# Altium schematic sheet IF 2.SchDoc
size A3; SheetNumber: 6; SheetTotal: 13
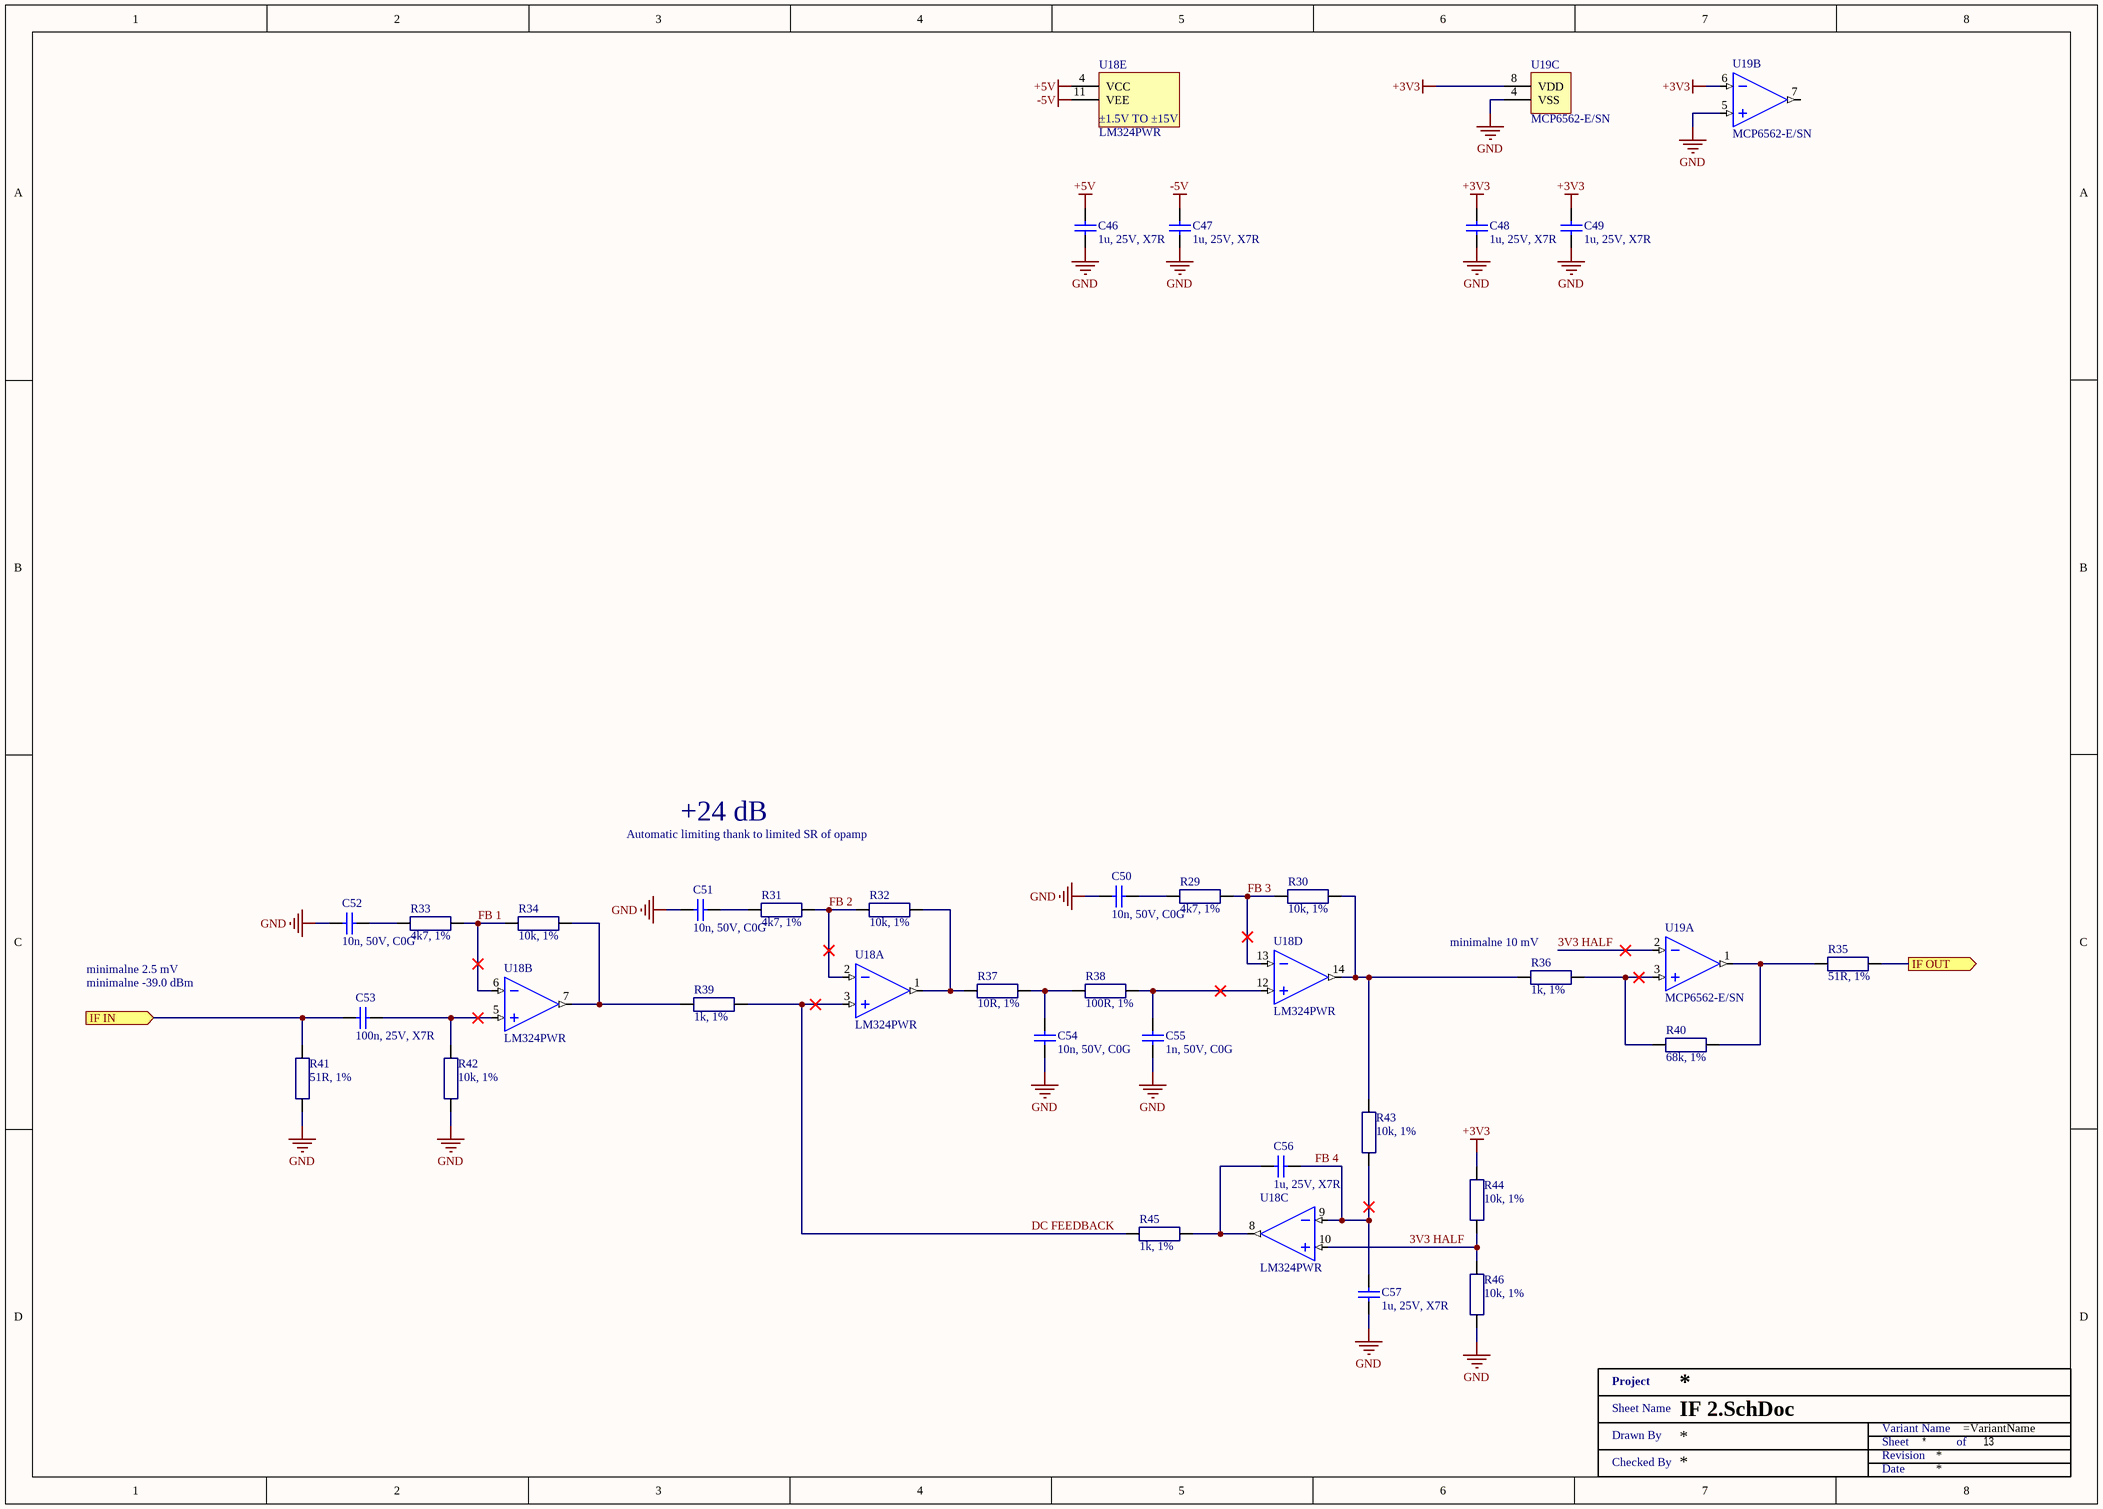
[diagram p0: IF 2.SchDoc]

## Parts
C46  1u, 25V, X7R  [SMD0603]
C47  1u, 25V, X7R  [SMD0603]
C48  1u, 25V, X7R  [SMD0603]
C49  1u, 25V, X7R  [SMD0603]
C50  10n, 50V, C0G  [SMD0603]
C51  10n, 50V, C0G  [SMD0603]
C52  10n, 50V, C0G  [SMD0603]
C53  100n, 25V, X7R  [SMD0603]
C54  10n, 50V, C0G  [SMD0603]
C55  1n, 50V, C0G  [SMD0603]
C56  1u, 25V, X7R  [SMD0603]
C57  1u, 25V, X7R  [SMD0603]
R29  4k7, 1%  [SMD0603 - R]
R30  10k, 1%  [SMD0603 - R]
R31  4k7, 1%  [SMD0603 - R]
R32  10k, 1%  [SMD0603 - R]
R33  4k7, 1%  [SMD0603 - R]
R34  10k, 1%  [SMD0603 - R]
R35  51R, 1%  [SMD0603 - R]
R36  1k, 1%  [SMD0603 - R]
R37  10R, 1%  [SMD0603 - R]
R38  100R, 1%  [SMD0603 - R]
R39  1k, 1%  [SMD0603 - R]
R40  68k, 1%  [SMD0603 - R]
R41  51R, 1%  [SMD0603 - R]
R42  10k, 1%  [SMD0603 - R]
R43  10k, 1%  [SMD0603 - R]
R44  10k, 1%  [SMD0603 - R]
R45  1k, 1%  [SMD0603 - R]
R46  10k, 1%  [SMD0603 - R]
U18  LM324PWR  [TSSOP14]  (parts A,B,C,D,E of 5)
U19  MCP6562-E/SN  [SOIC08]  (parts A,B,C of 3)
XX?  Title 1  (value not drawn)  (graphical)

## Ports
IF IN (in), IF OUT (out)

## Nets
+3V3: C48.2 C49.2 R44.2 U19.6(INB-) U19.8(VDD)
+5V: C46.2 U18.4(VCC)
-5V: C47.2 U18.11(VEE)
GND: C46.1 C47.1 C48.1 C49.1 C50.1 C51.1 C52.1 C54.1 C55.1 C57.1 R41.1 R42.1 R46.1 U19.4(VSS) U19.5(INB+)
3V3 HALF: R44.1 R46.2 U18.10(+IN_C) U19.2(INA-)
DC FEEDBACK: R39.2 R45.1 U18.3(+IN_A)
FB 1: R33.2 R34.1 U18.6(-IN_B)
FB 2: R31.2 R32.1 U18.2(-IN_A)
FB 3: R29.2 R30.1 U18.13(-IN_D)
FB 4: C56.1 C57.2 R43.1 U18.9(-IN_C)
IF IN: C53.1 R41.2 ; port IF IN
IF OUT: R35.2 ; port IF OUT
NetC50_2: C50.2 R29.1
NetC51_2: C51.2 R31.1
NetC52_2: C52.2 R33.1
NetC53_2: C53.2 R42.2 U18.5(+IN_B)
NetC54_2: C54.2 R37.2 R38.1
NetC55_2: C55.2 R38.2 U18.12(+IN_D)
NetC56_2: C56.2 R45.2 U18.8(OUT_C)
NetR30_2: R30.2 R36.1 R43.2 U18.14(OUT_D)
NetR32_2: R32.2 R37.1 U18.1(OUT_A)
NetR34_2: R34.2 R39.1 U18.7(OUT_B)
NetR35_1: R35.1 R40.2 U19.1(OUTA)
NetR36_2: R36.2 R40.1 U19.3(INA+)

Not connected (* = marked no-connect by the designer): U19 7(OUTB)

## Notes on the sheet
- Automatic limiting thank to limited SR of opamp
- +24 dB
- minimalne 2.5 mV
- minimalne -39.0 dBm
- (near R36) minimalne 10 mV
- (in symbol LM324PWR, part E) ±1.5V TO ±15V
- (in symbol Title 1) Project; Sheet Name; Variant Name; Drawn By; Sheet; of; Revision; Checked By; Date

## Library data of the parts
C46-C49 C56 C57 = CGA3E1X7R1E105K080AC: CAP CER 1UF 25V X7R 0603; Manufacturer: TDK Corporation; Tolerance: ±10%; Manufacturer Part Number: CGA3E1X7R1E105K080AC; RoHS: RoHS Compliant; Category: Capacitors; Stock 1: 109509; Pricing 1: 1=0.2, 10=0.135, 100=0.0686, 500=0.04696, 1000=0.04154 (USD); Packaging: Cut Tape (CT); Part Status: Active; Voltage - Rated: 25V; Temperature Coefficient: X7R; Operating Temperature: -55°C ~ 125°C; Features: -; Ratings: AEC-Q200; Applications: Automotive; Failure Rate: -; Mounting Type: Surface Mount, MLCC; Package / Case: 0603 (1608 Metric); Size / Dimension: 0.063" L x 0.032" W (1.60mm x 0.80mm); Height - Seated (Max): -; Thickness (Max): 0.035" (0.90mm); Lead Spacing: -; Lead Style: -; ComponentLink1URL: https://product.tdk.com/info/en/catalog/datasheets/mlcc_automotive_general_en.pdf; ComponentLink1Description: https://product.tdk.com/info/en/catalog/datasheets/mlcc_automotive_general_en.pdf; Capacitance: 1u; Supplier 1: Mouser; Supplier Part Number 1: 810-CGA3E1X7R1E105K; Supplier 2: Farnell; Supplier Part Number 2: 2346962; Supplier 3: Digi-Key; Supplier Part Number 3: 445-6931-1-ND
C50-C52 C54 = GRM1885C1H103JA01D: Multilayer Ceramic Capacitors MLCC - SMD/SMT 0603 50VDC 10000pF 5% C0G; Manufacturer: Murata Electronics; Type: Chip Multilayer Ceramic Capacitor for General Purpose; Capacitance - nF: 10 nF; Class: Class 1; CNHTS: 8532241000; Dielectric: C0G (NP0); TARIC: 8532240000; Supplier 1: Mouser; Supplier Part Number 1: 81-GRM1885C1H103JA1D; Manufacturer Part Number: GRM1885C1H103JA01D; RoHS: RoHS Compliant; Category: Multilayer Ceramic Capacitors MLCC - SMD/SMT; Stock 1: 217291; Pricing 1: 1=0.183, 10=0.129, 100=0.065, 500=0.045, 1000=0.039, 4000=0.030, 8000=0.027, 24000=0.025 (EUR); Capacitance: 10n; Height: 0.8 mm; Length: 1.6 mm; Package / Case: 0603 (1608 metric); Packaging: Cut Tape; Product: General Type MLCCs; Series: GRM; Termination Style: SMD/SMT; Tolerance: 5 %; Voltage Rating DC: 50 VDC; Width: 0.8 mm; Brand: Murata Electronics; Capacitance - pF: 10000 pF; Case Code - in: 0603; Case Code - mm: 1608; HTS Code: 8532240020; Maximum Operating Temperature: + 125 C; Minimum Operating Temperature: - 55 C; Product Type: Ceramic Capacitors; Standard Pack Qty: 4000; Subcategory: Capacitors; Termination: Standard; RoHS - Mouser: Y; Minimum Order Quantity: 1; Reeling: True; ComponentLink1URL: http://www.mouser.com/datasheet/2/281/murata_03052018_GRM_Series_1-1310166.pdf; ComponentLink1Description: http://www.mouser.com/datasheet/2/281/murata_03052018_GRM_Series_1-1310166.pdf; Supplier 2: Farnell; Supplier Part Number 2: 2456107
C53 = 06033C104KAT2A: AVX - 06033C104KAT2A - CAP, MLCC, X7R, 0.1UF, 25V, 0603; Ceramic Capacitor Case: 0603 [1608 Metric]; Voltage Rating: 25; Capacitance Tolerance: ± 10%; Dielectric Characteristic: X7; Product Range: AVX 0603 MLCC; SVHC: No SVHC (17-Dec-2015)<!--FANDB--><div class="features-and-benefits-container"><div class="features-and-benefits-desc-container"><span class="features-and-benefits-container-desc">SMD Multilayer Ceramic Capacitor, 0603 [1608 Metric], 0.1 µF, 25 V, ± 10%, X7R, AVX 0603 MLCC</span></div><div class="features-and-benefits-description"><span class="features-benefits-value">The 06033C104KAT2A is a SMD Multilayer Ceramic Capacitor with Ni/Sn-plated termination, X7R dielectric and 0603 case. X7R formulations are called temperature stable ceramics and fall into EIA class II materials. X7R is the most popular of this intermediate dielectric constant material. This capacitance change is non-linear. Capacitance for X7R varies under the influence of electrical operating conditions such as voltage and frequency. X7; Supplier 1: Farnell; Supplier Part Number 1: 2530141; Manufacturer: AVX; Manufacturer Part Number: 06033C104KAT2A; RoHS: YES; Stock 1: 22809; Pricing 1: 10=0.012, 100=0.0096, 500=0.0069, 1000=0.006, 2000=0.0048, 4000=0.0038, 20000=0.0027, 40000=0.0026 (GBP); Capacitance: 100n; Packaging: Cut Tape; Operating Temperature Min: -55; Operating Temperature Max: 125; Automotive Qualification Standard: -; MSL: MSL 1 - Unlimited; ComponentLink1URL: http://www.farnell.com/datasheets/2237835.pdf; ComponentLink1Description: http://www.farnell.com/datasheets/2237835.pdf; Supplier 2: Digi-Key; Supplier Part Number 2: 478-3714-1-ND
C55 = MCU0603C102JCT: MULTICOMP - MCU0603C102JCT - CAP, MLCC, C0G/NP0, 1NF, 50V, 0603; Ceramic Capacitor Case: 0603 [1608 Metric]; Voltage Rating: 50; Capacitance Tolerance: ± 5%; Product Range: MCU Series; SVHC: No SVHC (07-Jul-2017); Capacitance Tolerance +: 5%; Capacitor Terminals: SMD; External Depth: 0.8; External Length / Height: 1.6; No. of Pins: 2; Reel Quantity: 4000; Temperature Coefficient: 0ppm/°C ± 30; Voltage Rating V DC: 50V<!--FANDB--><div class="features-and-benefits-container"><div class="features-and-benefits-desc-container"><span class="features-and-benefits-container-desc">SMD Multilayer Ceramic Capacitor, 0603 [1608 Metric], 1000 pF, 50 V, ± 5%, C0G / NP0; Supplier 1: Farnell; Supplier Part Number 1: 9406131; Manufacturer: MULTICOMP; Manufacturer Part Number: MCU0603C102JCT; RoHS: YES; Stock 1: 25831; Pricing 1: 10=0.0164, 100=0.0133, 500=0.0095, 1000=0.0082, 2000=0.0065 (GBP); Capacitance: 1n; Dielectric Characteristic: C0G / NP0; Packaging: Cut Tape; Operating Temperature Min: -55; Operating Temperature Max: 125; Automotive Qualification Standard: -; MSL: -; Capacitance Tolerance ±: ± 5%; External Width: 0.8; Operating Temperature Range: -55°C to +125; Tape Width: 8; Tolerance +: 5%; Tolerance -: 5%; ComponentLink1URL: http://www.farnell.com/datasheets/1723231.pdf; ComponentLink1Description: http://www.farnell.com/datasheets/1723231.pdf
R29 R31 R33 = AC0603FR-074K7L: RES SMD 4.7K OHM 1% 1/10W 0603; Manufacturer: Yageo; Power (Watts): 0.1W, 1/10W; Temperature Coefficient: ±100ppm/°C; Manufacturer Part Number: AC0603FR-074K7L; RoHS: RoHS Compliant; Category: Resistors; Stock 1: 391581; Pricing 1: 1=0.1, 10=0.025, 100=0.01, 1000=0.00448, 2500=0.00389 (USD); Packaging: Cut Tape (CT); Part Status: Active; Tolerance: ±1%; Composition: Thick Film; Features: Automotive AEC-Q200, Moisture Resistant; Operating Temperature: -55°C ~ 155°C; Package / Case: 0603 (1608 Metric); Supplier Device Package: 0603; Size / Dimension: 0.063" L x 0.032" W (1.60mm x 0.80mm); Height - Seated (Max): 0.022" (0.55mm); Failure Rate: -; ComponentLink1URL: http://www.yageo.com/NewPortal/yageodocoutput?fileName=/pdf/R-Chip/PYu-AC_51_RoHS_L_6.pdf; ComponentLink1Description: http://www.yageo.com/NewPortal/yageodocoutput?fileName=/pdf/R-Chip/PYu-AC_51_RoHS_L_6.pdf; Resistance: 4k7; Supplier 1: Mouser; Supplier Part Number 1: 603-AC0603FR-074K7L; Supplier 2: Digi-Key; Supplier Part Number 2: YAG3613CT-ND; Supplier 3: Future Electronics; Supplier Part Number 3: AC0603FR-074K7L-CUTT
R30 R32 R34 R42-R44 R46 = RC0603FR-0710KL: YAGEO (PHYCOMP) - RC0603FR-0710KL - RES, THICK FILM, 10K, 1%, 0.1W, 0603; Voltage Rating: 50; Resistor Case Style: 0603 [1608 Metric]; Power Rating: 100; Product Range: RC Series; Temperature Coefficient: ± 100; SVHC: No SVHC (20-Jun-2016); Manufacturer: YAGEO (PHYCOMP); Manufacturer Part Number: RC0603FR-0710KL; RoHS: YES; Stock 1: 9995; Pricing 1: 5000=0.0025, 25000=0.0014, 50000=0.0013 (GBP); Resistance: 10k; Resistance Tolerance: ± 1%; Packaging: Tape & Reel; Resistor Element Material: Thick Film; Automotive Qualification Standard: -; MSL: MSL 1 - Unlimited<!--FANDB--><div class="features-and-benefits-container"><div class="features-and-benefits-desc-container"><span class="features-and-benefits-container-desc">SMD Chip Resistor, Thick Film, 10 kohm, 50 V, 0603 [1608 Metric], 100 mW, ± 1; ComponentLink1URL: http://past.yageo.com/pdf/PYu-R_Packing_6.pdf; ComponentLink1Description: http://past.yageo.com/pdf/PYu-R_Packing_6.pdf; ComponentLink2URL: http://www.farnell.com/datasheets/2167052.pdf; ComponentLink2Description: http://www.farnell.com/datasheets/2167052.pdf; Supplier 1: Mouser; Supplier Part Number 1: 603-RC0603FR-0710KL; Supplier 2: Farnell; Supplier Part Number 2: 2421850; Supplier 3: Digi-Key; Supplier Part Number 3: 311-10.0KHRCT-ND
R35 R41 = CRCW060351R0FKEA: RES SMD 51 OHM 1% 1/10W 0603; Manufacturer: Vishay Dale; Power (Watts): 0.1W, 1/10W; Temperature Coefficient: ±100ppm/°C; Manufacturer Part Number: CRCW060351R0FKEA; RoHS: RoHS Compliant; Category: Resistors; Stock 1: 21691; Pricing 1: 1=0.1, 10=0.042, 100=0.017, 1000=0.00764, 2500=0.00663 (USD); Packaging: Cut Tape (CT); Part Status: Active; Tolerance: ±1%; Composition: Thick Film; Features: Automotive AEC-Q200; Operating Temperature: -55°C ~ 155°C; Package / Case: 0603 (1608 Metric); Supplier Device Package: 0603; Size / Dimension: 0.063" L x 0.033" W (1.60mm x 0.85mm); Height - Seated (Max): 0.020" (0.50mm); Failure Rate: -; ComponentLink1URL: http://www.vishay.com/docs/20035/dcrcwe3.pdf; ComponentLink1Description: http://www.vishay.com/docs/20035/dcrcwe3.pdf; Resistance: 51R; Supplier 1: Mouser; Supplier Part Number 1: 71-CRCW0603-51-E3; Supplier 2: Farnell; Supplier Part Number 2: 1652889; Supplier 3: Digi-Key; Supplier Part Number 3: 541-51.0HCT-ND
R36 R39 R45 = MCWR06X1001FTL: MULTICOMP - MCWR06X1001FTL - RES, THICK FILM, 1K, 1%, 0.1W, 0603; Voltage Rating: 50; Resistor Case Style: 0603 [1608 Metric]; Power Rating: 100; Product Range: MCWR Series; Temperature Coefficient: ± 100; SVHC: No SVHC (07-Jul-2017)<!--FANDB--><div class="features-and-benefits-container"><div class="features-and-benefits-desc-container"><span class="features-and-benefits-container-desc">SMD Chip Resistor, Thick Film, 1 kohm, 50 V, 0603 [1608 Metric], 100 mW, ± 1; Manufacturer: MULTICOMP; Manufacturer Part Number: MCWR06X1001FTL; RoHS: Y-EX; Stock 1: 134740; Pricing 1: 10=0.0037, 100=0.0022, 500=0.0016, 1000=0.0012, 2500=0.001 (GBP); Resistance: 1k; Resistance Tolerance: ± 1%; Packaging: Cut Tape; Resistor Element Material: Thick Film; Automotive Qualification Standard: -; ComponentLink1URL: http://www.farnell.com/datasheets/1849611.pdf; ComponentLink1Description: http://www.farnell.com/datasheets/1849611.pdf; Supplier 1: Farnell; Supplier Part Number 1: 2447272; Supplier 2: Newark; Supplier Part Number 2: 94X1378
R37 = CRCW060310R0FKEAC: D11/CRCW0603-C 100 10R 1%; Manufacturer: Vishay Dale; Power (Watts): 0.1W, 1/10W; Temperature Coefficient: ±100ppm/°C; Manufacturer Part Number: CRCW060310R0FKEAC; RoHS: RoHS Compliant; Category: Resistors; Stock 1: 49728; Pricing 1: 1=0.1, 10=0.027, 100=0.0108, 1000=0.00487, 2500=0.00422 (USD); Packaging: Cut Tape (CT); Part Status: Active; Tolerance: ±1%; Composition: Thick Film; Features: -; Operating Temperature: -55°C ~ 155°C; Package / Case: 0603 (1608 Metric); Supplier Device Package: 0603; Height - Seated (Max): 0.022" (0.55mm); Failure Rate: -; ComponentLink1URL: http://www.vishay.com/docs/28773/crcwce3.pdf; ComponentLink1Description: http://www.vishay.com/docs/28773/crcwce3.pdf; Resistance: 10R; Supplier 1: Mouser; Supplier Part Number 1: 71-CRCW060310R0FKEAC; Supplier 2: Digi-Key; Supplier Part Number 2: 541-3952-1-ND
R38 = MCWR06X1000FTL: MULTICOMP - MCWR06X1000FTL - RES, THICK FILM, 100R, 1%, 0.1W, 0603; Voltage Rating: 50; Resistor Case Style: 0603 [1608 Metric]; Power Rating: 100; Product Range: MCWR Series; Temperature Coefficient: ± 100; SVHC: No SVHC (07-Jul-2017)<!--FANDB--><div class="features-and-benefits-container"><div class="features-and-benefits-desc-container"><span class="features-and-benefits-container-desc">SMD Chip Resistor, Thick Film, 100 ohm, 50 V, 0603 [1608 Metric], 100 mW, ± 1%, MCWR Series</span></div><div class="features-and-benefits-description"><span class="features-benefits-value">The MCWR06X1000FTL is a thick film Chip Resistor with 0603 chip format. The resistor is constructed in a high grade ceramic body (aluminium oxide). Internal metal electrodes are added at each end and connected by a resistive paste that is applied to the top surface of the substrate. The composition of the paste is adjusted to give the approximate resistance required and the value is trimmed to within tolerance by laser cutting of this resistive layer.</span></div><div class="features-and-benefits-list"><ul class="features-and-benefits-list-list"><li class="features-and-benefits-list-item">High reliability and stability</li><li class="features-and-benefits-list-item">Reduced size of final equipment</li><li class="features-and-benefits-list-item">Lower assembly costs</li><li class="features-and-benefits-list-item">Higher component and equipment reliability</li></ul></div><div class="features-and-benefits-applications"><ul class="features-and-benefits-value"><li class="features-and-benefits-list-item">Consumer Electronics</li><li class="features-and-benefits-list-item">Computers & Computer Peripherals</li><li class="features-and-benefits-list-item">Communications & Networking</li></ul></div></div>; Supplier 1: Farnell; Supplier Part Number 1: 2447227; Manufacturer: MULTICOMP; Manufacturer Part Number: MCWR06X1000FTL; RoHS: Y-EX; Stock 1: 246691; Pricing 1: 10=0.0032, 100=0.002, 500=0.0013, 1000=0.0011, 2500=0.0009 (GBP); Resistance: 100R; Resistance Tolerance: ± 1%; Packaging: Cut Tape; Resistor Element Material: Thick Film; Automotive Qualification Standard: -; ComponentLink1URL: http://www.farnell.com/datasheets/1849611.pdf; ComponentLink1Description: http://www.farnell.com/datasheets/1849611.pdf
R40 = RC0603FR-0768KL: RES SMD 68K OHM 1% 1/10W 0603; Manufacturer: Yageo; Power (Watts): 0.1W, 1/10W; Temperature Coefficient: ±100ppm/°C; Manufacturer Part Number: RC0603FR-0768KL; RoHS: RoHS Compliant; Category: Resistors; Stock 1: 1240858; Pricing 1: 1=0.1, 10=0.015, 100=0.006, 1000=0.00268, 2500=0.00233 (USD); Packaging: Cut Tape (CT); Part Status: Active; Tolerance: ±1%; Composition: Thick Film; Features: Moisture Resistant; Operating Temperature: -55°C ~ 155°C; Package / Case: 0603 (1608 Metric); Supplier Device Package: 0603; Size / Dimension: 0.063" L x 0.032" W (1.60mm x 0.80mm); Height - Seated (Max): 0.022" (0.55mm); Failure Rate: -; ComponentLink1URL: http://www.yageo.com/documents/recent/PYu-RC_Group_51_RoHS_L_8.pdf; ComponentLink1Description: http://www.yageo.com/documents/recent/PYu-RC_Group_51_RoHS_L_8.pdf; Resistance: 68k; Supplier 1: Mouser; Supplier Part Number 1: 603-RC0603FR-0768KL; Supplier 2: Farnell; Supplier Part Number 2: 9238700; Supplier 3: Digi-Key; Supplier Part Number 3: 311-68.0KHRCT-ND
U18 = LM324PWR: OP-AMP, 1.2MHZ, 0.5V/ US, TSSOP-14; Manufacturer: TEXAS INSTRUMENTS; Bandwidth: 1.2; No. of Amplifiers: 4; Slew Rate: 0.5; Supply Voltage Range: ± 1.5V to ± 16; Amplifier Case Style: TSSOP; No. of Pins: 14; SVHC: No SVHC (17-Dec-2014); Filter Terminals: SMD; Input Bias Current: 250000; Op Amp Type: High Gain; Output Current: 20; Quiescent Current: 0.3; Supply Voltage Max: 32; Supply Voltage Min: 3; Parameter 1: Jellybean; Manufacturer Part Number: LM324PWR; RoHS: YES; Stock 1: 1889; Pricing 1: 5=0,171, 50=0,15, 250=0,126, 500=0,125, 1000=0,125 (EUR); Operating Temperature Min: 0; Operating Temperature Max: 70; Packaging: Cut Tape; MSL: MSL 1 - Unlimited; Amplifer Supply Voltage: ± 1.5V to ± 16; Operating Temperature Range: 0°C to +70; ComponentLink1URL: http://www.farnell.com/datasheets/1877076.pdf; ComponentLink1Description: http://www.farnell.com/datasheets/1877076.pdf; Stock 3: 1204; Pricing 3: 1=0,24, 10=0,23, 100=0,23, 250=0,22, 500=0,21, 1000=0,21, 3000=0,171, 10000=0,157 (EUR); ComponentLink2URL: http://www.farnell.com/datasheets/378369.pdf; ComponentLink2Description: http://www.farnell.com/datasheets/378369.pdf; Supplier 1: Mouser; Supplier 2: Farnell; Supplier Part Number 2: 2342289; Supplier Part Number 1: 595-LM324PWR
U19 = MCP6562-E/SN: Microchip MCP6562-E/SN Dual Comparator, Push-Pull O/P, 3 V, 5 V 8-Pin SOIC; Max Supply Voltage: 5.5V; Min Supply Voltage: 1.8V; Common Mode Rejection Ratio: 66dB; Number of Channels: 2; Nominal Supply Current: 130uA; Propagation Delay: 80ns; Input Offset Voltage (Vos): 10mV; Input Bias Current: 1pA; Output Current: 50mA; Hysteresis: 5mV; Turn-On Delay Time: 45ns; Power Supply Rejection Ratio (PSRR): 70dB; Natural Thermal Resistance: 163°C/W; Response Time: 49ns; Output Type: TTL,PUSH-PULL; Supplier 1: Mouser; Supplier Part Number 1: 579-MCP6562-E/SN; Manufacturer: Microchip; Manufacturer Part Number: MCP6562-E/SN; RoHS: Yes; Category: Comparators; Stock 1: 2727; Pricing 1: 1=0.85000, 10=0.84800, 25=0.71100, 50=0.71100, 100=0.65900, 1000=0.65900, 10000=0.65900 (USD); Mount: Surface Mount; Case/Package: SOIC; Number of Pins: 8; Min Operating Temperature: -40°C; Max Operating Temperature: 125°C; Packaging: Rail/Tube; Number of Elements: 2; Package Quantity: 100; Quiescent Current: 130uA; Max Supply Current: 130uA; Type: General Purpose; Supply Current: 130uA; Technology: CMOS; Length: 4.9mm; Width: 3.9mm; Height: 1.25mm; Radiation Hardening: No; REACH SVHC: No SVHC; Lead Free: Lead Free; RoHS Compliant: Yes; ComponentLink1URL: https://datasheet.ciiva.com/1576/22139b-1576720.pdf?src-supplier=Newark; ComponentLink1Description: https://datasheet.ciiva.com/1576/22139b-1576720.pdf?src-supplier=Newark; ComponentLink2URL: https://datasheet.ciiva.com/15131/getdatasheetpartid-771954-15131482.pdf?src-supplier=Verical; ComponentLink2Description: https://datasheet.ciiva.com/15131/getdatasheetpartid-771954-15131482.pdf?src-supplier=Verical; ComponentLink3URL: https://datasheet.ciiva.com/26344/651517-da-01-en-ic-comp-mcp6562-e-sn-soic-8n-mcp-26344456.pdf?src-supplier=Conrad; ComponentLink3Description: https://datasheet.ciiva.com/26344/651517-da-01-en-ic-comp-mcp6562-e-sn-soic-8n-mcp-26344456.pdf?src-supplier=Conrad; ComponentLink4URL: https://datasheet.ciiva.com/1483/630456-1483745.pdf?src-supplier=Element14; ComponentLink4Description: https://datasheet.ciiva.com/1483/630456-1483745.pdf?src-supplier=Element14; ComponentLink5URL: https://datasheet.ciiva.com/2971/jp540574-2971157.pdf?src-supplier=Avnet; ComponentLink5Description: https://datasheet.ciiva.com/2971/jp540574-2971157.pdf?src-supplier=Avnet; ComponentLink6URL: https://datasheet.ciiva.com/16450/filehandler-aspxddocname-en540574-16450650.pdf?src-supplier=Future+Electronics; ComponentLink6Description: https://datasheet.ciiva.com/16450/filehandler-aspxddocname-en540574-16450650.pdf?src-supplier=Future+Electronics; ComponentLink7URL: https://datasheet.ciiva.com/1828/22139b-1828444.pdf?src-supplier=Digi-Key; ComponentLink7Description: https://datasheet.ciiva.com/1828/22139b-1828444.pdf?src-supplier=Digi-Key; ComponentLink8URL: https://datasheet.ciiva.com/17548/jp540574-17548718.pdf?src-supplier=Avnet+Europe; ComponentLink8Description: https://datasheet.ciiva.com/17548/jp540574-17548718.pdf?src-supplier=Avnet+Europe; ComponentLink9URL: https://datasheet.ciiva.com/12288/22139a-12288079.pdf?src-supplier=Mouser; ComponentLink9Description: https://datasheet.ciiva.com/12288/22139a-12288079.pdf?src-supplier=Mouser; Supplier 2: Farnell; Supplier Part Number 2: 1715875; Supplier 3: RSComponents; Supplier Part Number 3: 6696275